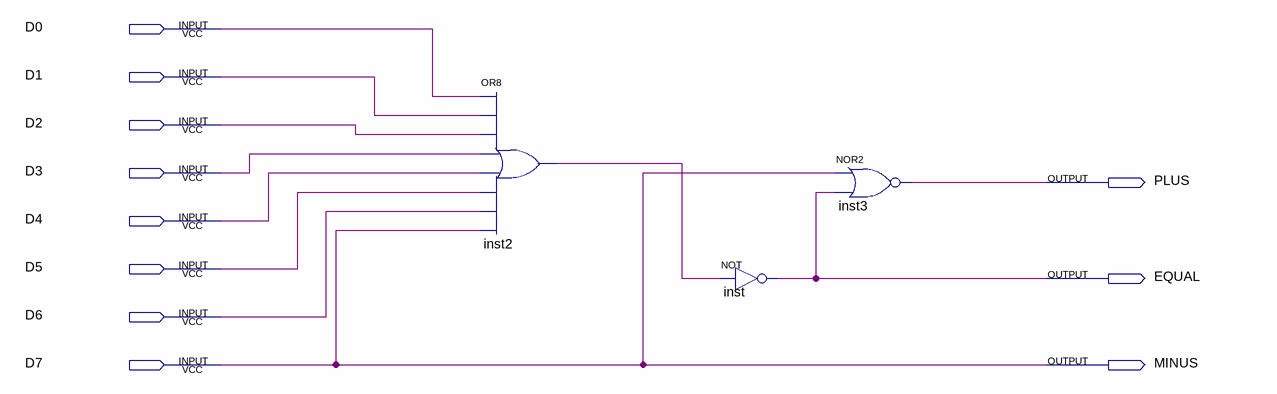
[diagram p0: schematic sheet]
// Quartus schematic 8-3.bdf as structural Verilog: 3 symbols, 11 pins
module \8-3  (
  input  D0,
  input  D1,
  input  D2,
  input  D3,
  input  D4,
  input  D5,
  input  D6,
  input  D7,
  output PLUS,
  output EQUAL,
  output MINUS
);

  wire inst2_out;

  or inst2 (inst2_out, D0, D1, D2, D3, D4, D5, D6, D7);
  not inst (EQUAL, inst2_out);
  nor inst3 (PLUS, D7, EQUAL);

  assign MINUS = D7;
endmodule
